# Altium schematic sheet power2V5.SchDoc
size A4; DocumentNumber: 8; SheetNumber: 8; SheetTotal: 11
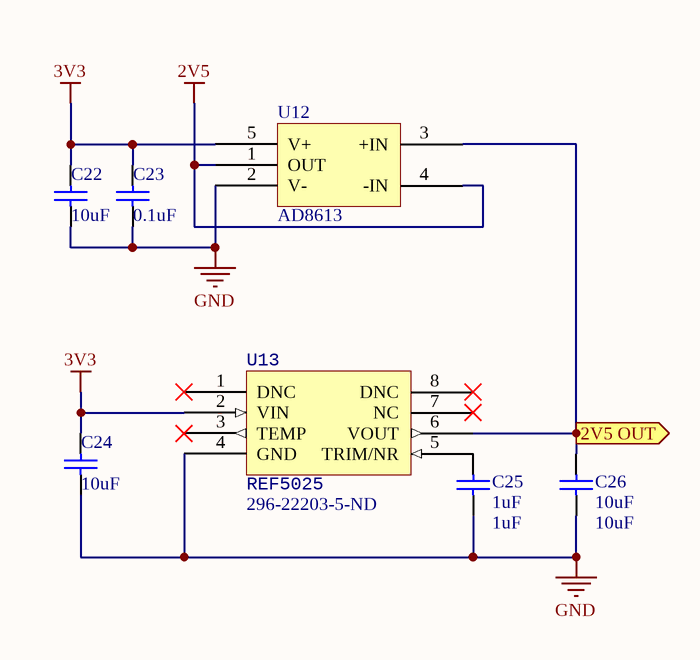
[diagram p0: power2V5.SchDoc]

## Parts
C22  10uF  [1608[0603]]
C23  0.1uF  [1608[0603]]
C24  10uF  [1608[0603]]
C25  1uF  [1608[0603]]
C26  10uF  [1608[0603]]
U12  AD8613  [SOP-65P200X125-5N]
U13  REF5025  Supplier Part Number 1: 296-22203-5-ND  [SOIC127P500X600-8N]

## Ports
2V5 OUT (out)

## Nets
2V5: U12.1(OUT) U12.4(-IN)
3V3: C22.2 C23.2 C24.2 U12.5(V+) U13.2(VIN)
GND: C22.1 C23.1 C24.1 C25.1 C26.1 U12.2(V-) U13.4(GND)
2V5 OUT: C26.2 U12.3(+IN) U13.6(VOUT) ; port 2V5 OUT
NetC25_2: C25.2 U13.5(TRIM/NR)

Not connected (* = marked no-connect by the designer): U13 1(DNC)* 3(TEMP)* 7(NC)* 8(DNC)*

## Library data of the parts
C22-C26 = Cap Semi: Capacitor (Semiconductor SIM Model); Published: 8-Jun-2000; LatestRevisionDate: 29-May-2009; LatestRevisionNote: IPC-7351 Footprint Added.; PackageReference: C1206; Publisher: Altium Limited; PackageDescription: Chip Capacitor; Supplier: Digi-Key
  C22 C24 C26: Value: 10uF; Supplier Part Number: 587-3258-1-ND
  C23: Value: 0.1uF; Supplier Part Number: 587-3807-1-ND
  C25: Value: 1uF; Supplier Part Number: 490-1550-1-ND
U12 = AD8613: Low power, low noise rail-to-rail op-amp.; Supplier: Digi-Key
U13 = REF5025: Voltage Reference; Supplier 1: Digi-Key; Supplier: Digi-Key